# EAGLE design phoreo (EAGLE 9.0.0)
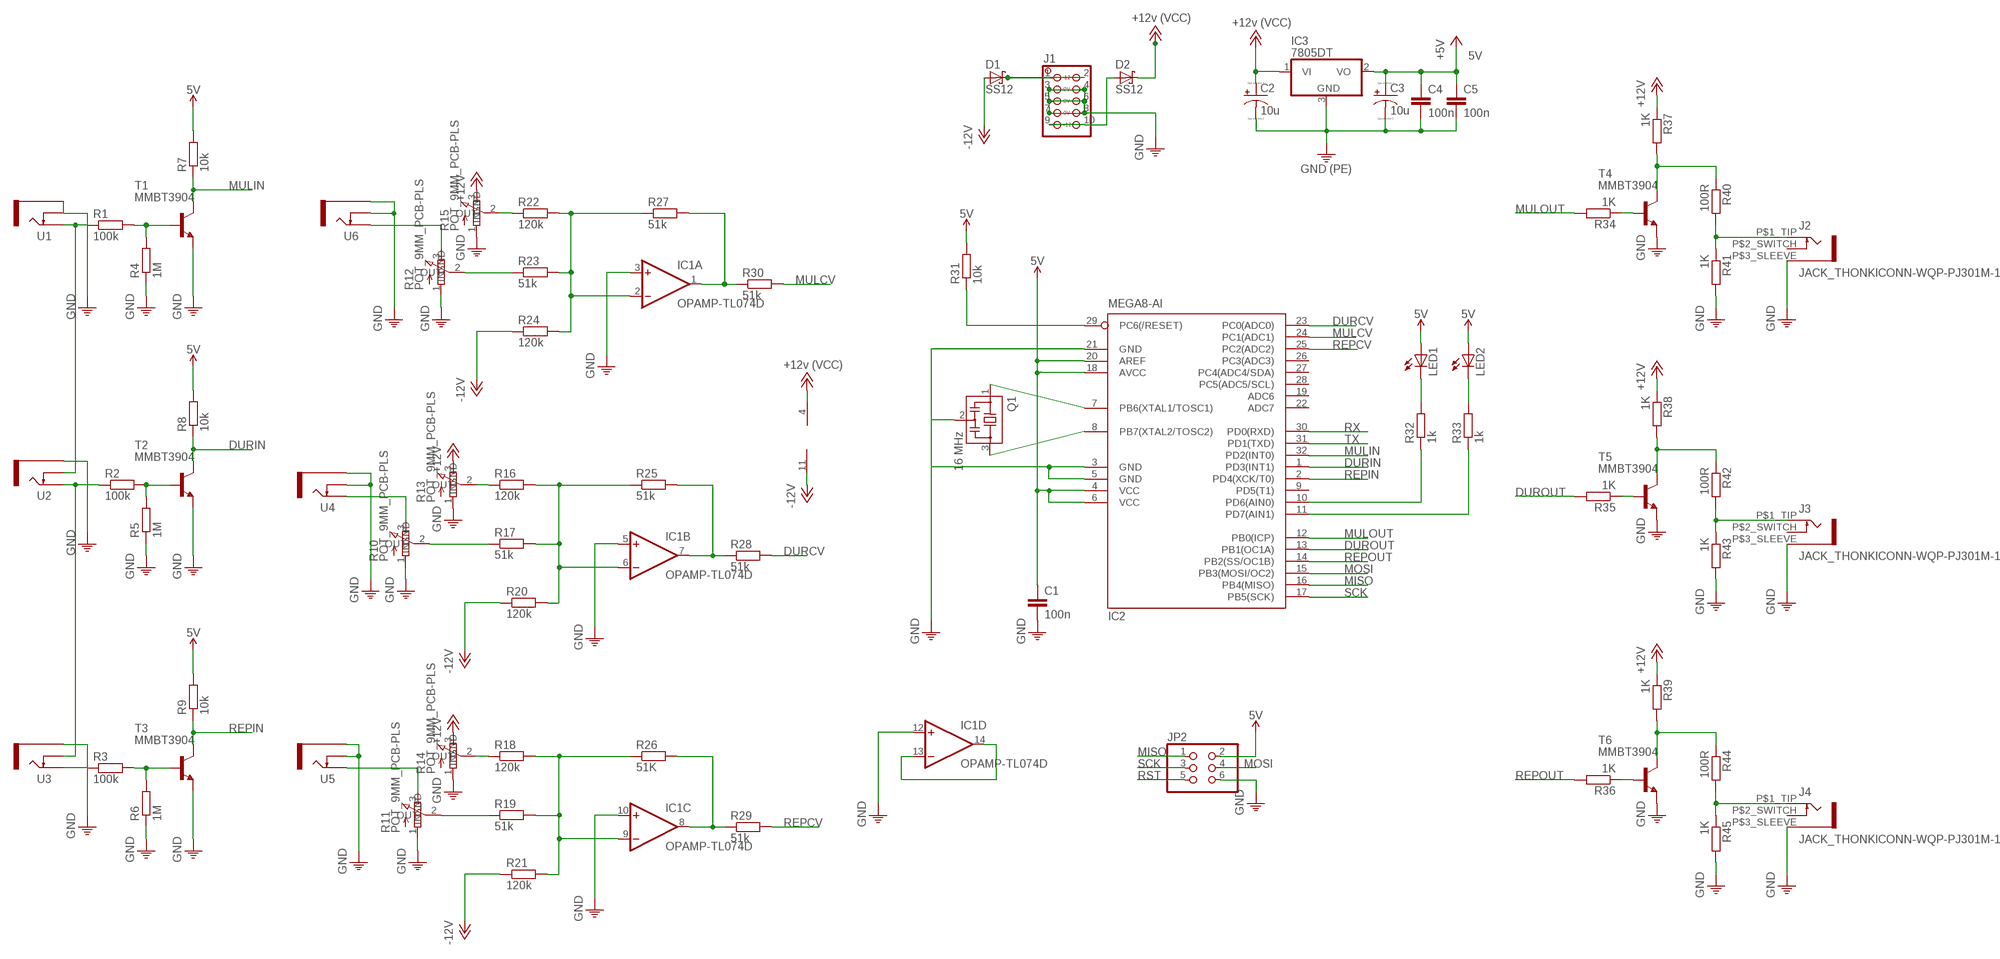
[diagram p0: schematic, sheet 1]

## Parts
C1  100n  CAPACITOR-EUC0603K  [C0603K]
C2  10u  CAPACITOR_POLARIZED-USB  [PANASONIC_B]
C3  10u  CAPACITOR_POLARIZED-USB  [PANASONIC_B]
C4  100n  CAPACITOR-EUC0603  [C0603]
C5  100n  CAPACITOR-EUC0603  [C0603]
D1  SS12  D_SCHOTTKY-SMA  [SMA_DO214AC]
D2  SS12  D_SCHOTTKY-SMA  [SMA_DO214AC]
IC1  OPAMP-TL074D  [SO14]
IC2  MEGA8-AI  [TQFP32-08]
IC3  7805DT  [TO252]
J1  HEADER-EUROPWR_2X05-OPEN  [2X05_EUROPWR_OPEN]
J2  JACK_THONKICONN-WQP-PJ301M-12  [WQP-PJ301M-12_JACK]
J3  JACK_THONKICONN-WQP-PJ301M-12  [WQP-PJ301M-12_JACK]
J4  JACK_THONKICONN-WQP-PJ301M-12  [WQP-PJ301M-12_JACK]
JP2  PINHD-2X3  [2X03]
LED1  LED3MM  [LED3MM]
LED2  LED3MM  [LED3MM]
Q1  16 MHz  CSTCR6M00G53Z  [CSTCR6M]
R1  100k  RESISTOR-EU_R0603  [R0603]
R2  100k  RESISTOR-EU_R0603  [R0603]
R3  100k  RESISTOR-EU_R0603  [R0603]
R4  1M  RESISTOR-EU_R0603  [R0603]
R5  1M  RESISTOR-EU_R0603  [R0603]
R6  1M  RESISTOR-EU_R0603  [R0603]
R7  10k  RESISTOR-EU_R0603  [R0603]
R8  10k  RESISTOR-EU_R0603  [R0603]
R9  10k  RESISTOR-EU_R0603  [R0603]
R10  POT_9MM_PCB-PLS  [9MM_PLS]
R11  POT_9MM_PCB-PLS  [9MM_PLS]
R12  POT_9MM_PCB-PLS  [9MM_PLS]
R13  POT_9MM_PCB-PLS  [9MM_PLS]
R14  POT_9MM_PCB-PLS  [9MM_PLS]
R15  POT_9MM_PCB-PLS  [9MM_PLS]
R16  120k  RESISTOR-EU_R0603  [R0603]
R17  51k  RESISTOR-EU_R0603  [R0603]
R18  120k  RESISTOR-EU_R0603  [R0603]
R19  51k  RESISTOR-EU_R0603  [R0603]
R20  120k  RESISTOR-EU_R0603  [R0603]
R21  120k  RESISTOR-EU_R0603  [R0603]
R22  120k  RESISTOR-EU_R0603  [R0603]
R23  51k  RESISTOR-EU_R0603  [R0603]
R24  120k  RESISTOR-EU_R0603  [R0603]
R25  51k  RESISTOR-EU_R0603  [R0603]
R26  51K  RESISTOR-EU_R0603  [R0603]
R27  51k  RESISTOR-EU_R0603  [R0603]
R28  51k  RESISTOR-EU_R0603  [R0603]
R29  51k  RESISTOR-EU_R0603  [R0603]
R30  51k  RESISTOR-EU_R0603  [R0603]
R31  10k  RESISTOR-EU_R0603  [R0603]
R32  1k  RESISTOR-EU_R0603  [R0603]
R33  1k  RESISTOR-EU_R0603  [R0603]
R34  1K  RESISTOR-EU_R0603  [R0603]
R35  1K  RESISTOR-EU_R0603  [R0603]
R36  1K  RESISTOR-EU_R0603  [R0603]
R37  1K  RESISTOR-EU_R0603  [R0603]
R38  1K  RESISTOR-EU_R0603  [R0603]
R39  1K  RESISTOR-EU_R0603  [R0603]
R40  100R  RESISTOR-EU_R0603  [R0603]
R41  1K  RESISTOR-EU_R0603  [R0603]
R42  100R  RESISTOR-EU_R0603  [R0603]
R43  1K  RESISTOR-EU_R0603  [R0603]
R44  100R  RESISTOR-EU_R0603  [R0603]
R45  1K  RESISTOR-EU_R0603  [R0603]
T1  MMBT3904  TRANSISTOR-NPN-MMBT3904LT1SOT23-BEC  [SOT23-BEC]
T2  MMBT3904  TRANSISTOR-NPN-MMBT3904LT1SOT23-BEC  [SOT23-BEC]
T3  MMBT3904  TRANSISTOR-NPN-MMBT3904LT1SOT23-BEC  [SOT23-BEC]
T4  MMBT3904  TRANSISTOR-NPN-MMBT3904LT1SOT23-BEC  [SOT23-BEC]
T5  MMBT3904  TRANSISTOR-NPN-MMBT3904LT1SOT23-BEC  [SOT23-BEC]
T6  MMBT3904  TRANSISTOR-NPN-MMBT3904LT1SOT23-BEC  [SOT23-BEC]
U1  mulcv  JACK_THONKICONNNEW  [WQP-PJ301M-12_JACK]
U2  mulcv  JACK_THONKICONNNEW  [WQP-PJ301M-12_JACK]
U3  mulcv  JACK_THONKICONNNEW  [WQP-PJ301M-12_JACK]
U4  mulcv  JACK_THONKICONNNEW  [WQP-PJ301M-12_JACK]
U5  mulcv  JACK_THONKICONNNEW  [WQP-PJ301M-12_JACK]
U6  mulcv  JACK_THONKICONNNEW  [WQP-PJ301M-12_JACK]

## Nets
5V: C1.1 C3.+ C4.1 C5.1 IC2.4(VCC) IC2.6(VCC) IC2.18(AVCC) IC2.20(AREF) IC3.2(VO) JP2.2 LED1.A LED2.A R7.2 R8.2 R9.2 R31.2 ; supply symbol labelled +5V
+12V [GND]: C2.+ D2.C IC1.4(P:V+) IC3.1(VI) R13.3(IN) R14.3(IN) R15.3(IN) R37.1 R38.1 R39.1 ; supply symbol labelled POWER+12V
-12V [GND]: D1.A IC1.11(P:V-) R20.1 R21.1 R24.1
DURCV: IC2.23(PC0(ADC0)) R28.2
DURIN: IC2.1(PD3(INT1)) R8.1 T2.C
DUROUT: IC2.13(PB1(OC1A)) R35.2
MISO: IC2.16(PB4(MISO)) JP2.1
MOSI: IC2.15(PB3(MOSI/OC2)) JP2.4
MULCV: IC2.24(PC1(ADC1)) R30.2
MULIN: IC2.32(PD2(INT0)) R7.1 T1.C
MULOUT: IC2.12(PB0(ICP)) R34.2
N$2: IC2.7(PB6(XTAL1/TOSC1)) Q1.1
N$3: D1.C J1.1 J1.2
N$4: IC2.8(PB7(XTAL2/TOSC2)) Q1.3
N$5: IC2.29(PC6(/RESET)) R31.1
N$6: R34.1 T4.B
N$7 [GND]: D2.A J1.9 J1.10
N$8: IC2.10(PD6(AIN0)) R32.1
N$9: IC2.11(PD7(AIN1)) R33.1
N$10: LED1.K(C) R32.2
N$11: LED2.K(C) R33.2
N$12: IC1.2(A:-IN) R22.2 R23.2 R24.2 R27.1
N$13: IC1.1(A:OUT) R27.2 R30.1
N$14: IC1.6(B:-IN) R16.2 R17.2 R20.2 R25.1
N$15: IC1.7(B:OUT) R25.2 R28.1
N$16: R10.3(IN) U4.P$1_TIP(TIP)
N$17: R10.2(OUT) R17.1
N$18: R12.3(IN) U6.P$1_TIP(TIP)
N$19: R12.2(OUT) R23.1
N$20: R15.2(OUT) R22.1
N$21: R13.2(OUT) R16.1
N$22: IC1.9(C:-IN) R18.2 R19.2 R21.2 R26.1
N$23: IC1.8(C:OUT) R26.2 R29.1
N$24: R11.3(IN) U5.P$1_TIP(TIP)
N$25: R11.2(OUT) R19.1
N$26: R14.2(OUT) R18.1
N$27: IC1.13(D:-IN) IC1.14(D:OUT)
N$28: R37.2 R40.1 T4.C
N$29: J2.P$1_TIP R40.2 R41.1
N$30: R35.1 T5.B
N$31: R38.2 R42.1 T5.C
N$32: J3.P$1_TIP R42.2 R43.1
N$33: R36.1 T6.B
N$34: R39.2 R44.1 T6.C
N$35: J4.P$1_TIP R44.2 R45.1
N$36: R1.1 U1.P$1_TIP(TIP) U2.P$2_SWITCH(SWITCH)
N$37: R1.2 R4.2 T1.B
N$38 [GND]: R2.1 U2.P$1_TIP(TIP) U3.P$2_SWITCH(SWITCH)
N$40: R2.2 R5.2 T2.B
N$42: R3.1 U3.P$1_TIP(TIP)
N$43: R3.2 R6.2 T3.B
PE [GND]: C1.2 C2.- C3.- C4.2 C5.2 IC1.3(A:+IN) IC1.5(B:+IN) IC1.10(C:+IN) IC1.12(D:+IN) IC2.3(GND) IC2.5(GND) IC2.21(GND) IC3.3(GND) J1.3 J1.4 J1.5 J1.6 J1.7 J1.8 J2.P$3_SLEEVE J3.P$3_SLEEVE J4.P$3_SLEEVE JP2.6 Q1.2 R4.1 R5.1 R6.1 R10.1(GND) R11.1(GND) R12.1(GND) R13.1(GND) R14.1(GND) R15.1(GND) R41.2 R43.2 R45.2 T1.E T2.E T3.E T4.E T5.E T6.E U1.P$2_SWITCH(SWITCH) U1.P$3_SLEEVE(SLEEVE) U2.P$3_SLEEVE(SLEEVE) U3.P$3_SLEEVE(SLEEVE) U4.P$2_SWITCH(SWITCH) U4.P$3_SLEEVE(SLEEVE) U5.P$2_SWITCH(SWITCH) U5.P$3_SLEEVE(SLEEVE) U6.P$2_SWITCH(SWITCH) U6.P$3_SLEEVE(SLEEVE) ; supply symbol labelled GND, POWER-GND
REPCV: IC2.25(PC2(ADC2)) R29.2
REPIN: IC2.2(PD4(XCK/T0)) R9.1 T3.C
REPOUT: IC2.14(PB2(SS/OC1B)) R36.2
RST: JP2.5
RX: IC2.30(PD0(RXD))
SCK: IC2.17(PB5(SCK)) JP2.3
TX: IC2.31(PD1(TXD))
Unconnected: IC2.9(PD5(T1)) IC2.19(ADC6) IC2.22(ADC7) IC2.26(PC3(ADC3)) IC2.27(PC4(ADC4/SDA)) IC2.28(PC5(ADC5/SCL)) J2.P$2_SWITCH J3.P$2_SWITCH J4.P$2_SWITCH

## Library data of the parts
C1 C4 C5 = 0000-master:CAPACITOR-EU: CAPACITOR, European symbol
C2 C3 = 0000-master:CAPACITOR_POLARIZED-US: POLARIZED CAPACITOR, American symbol
D1 D2 = we-rcl:D_SCHOTTKY: Schottky Diodes 1A, 30V - SOD323 (BAS3010 or CUS10S40) 3A, 100V - SOD123 (S310A)
IC1 = 0000-master:OPAMP-TL074: OP AMP
IC2 = atmel:MEGA8: MICROCONTROLLER 8 Kbytes FLASH, 1 kbytes SRAM, 512 bytes EEPROM, USART, 6-channel 10 bit ADC, 2-channel 8 bit ADC Pin compatible with Atmega48, ATMega88, ATMega168 Source: avr.lbr; MPN: ATMEGA8-16AU; OC_FARNELL: 9171371; OC_NEWARK: 73M8863
IC3 = linear:78*: Positive VOLTAGE REGULATOR Source: http://cache.national.com/ds/LM/LM78L05.pdf http://www.fairchildsemi.com/ds/LM/LM7805.pdf
J1 = 0000-master:HEADER-EUROPWR_2X05: 2x05 pin header
J2-J4 = 0000-master:JACK_THONKICONN-WQP-PJ301M-12
JP2 = pinhead:PINHD-2X3: PIN HEADER
LED1 LED2 = 0000-master:LED: LED OSRAM: - CHIPLED LG R971, LG N971, LY N971, LG Q971, LY Q971, LO R971, LY R971 LH N974, LH R974 LS Q976, LO Q976, LY Q976 LO Q996 - Hyper CHIPLED LW Q18S LB Q993, LB Q99A, LB R99A - SideLED LS A670, LO A670, LY A670, LG A670, LP A670 LB A673, LV A673, LT A673, LW A673 LH A674 LY A675 LS A676, LA A676, LO A676, LY A676, LW A676 LS A679, LY A679, LG A679 - Hyper Micro SIDELED® LS Y876, LA Y876, LO Y876, LY Y876 LT Y87S - SmartLED LW L88C, LW L88S LB L89C, LB L89S, LG L890 LS L89K, LO L89K, LY L89K LS L896, LA L896, LO L896, LY L896 - TOPLED LS T670, LO T670, LY T670, LG T670, LP T670 LSG T670, LSP T670, LSY T670, LOP T670, LYG T670 LG T671, LOG T671, LSG T671 LB T673, LV T673, LT T673, LW T673 LH T674 LS T676, LA T676, LO T676, LY T676, LB T676, LH T676, LSB T676, LW T676 LB T67C, LV T67C, LT T67C, LS T67K, LO T67K, LY T67K, LW E67C LS E67B, LA E67B, LO E67B, LY E67B, LB E67C, LV E67C, LT E67C LW T67C LS T679, LY T679, LG T679 LS T770, LO T770, LY T770, LG T770, LP T770 LB T773, LV T773, LT T773, LW T773 LH T774 LS E675, LA E675, LY E675, LS T675 LS T776, LA T776, LO T776, LY T776, LB T776 LHGB T686 LT T68C, LB T68C - Hyper Mini TOPLED® LB M676 - Mini TOPLED Santana® LG M470 LS M47K, LO M47K, LY M47K Source: http://www.osram.convergy.de LUXEON: - LUMILED® LXK2-PW12-R00, LXK2-PW12-S00, LXK2-PW14-U00, LXK2-PW14-V00 LXK2-PM12-R00, LXK2-PM12-S00, LXK2-PM14-U00 LXK2-PE12-Q00, LXK2-PE12-R00, LXK2-PE12-S00, LXK2-PE14-T00, LXK2-PE14-U00 LXK2-PB12-K00, LXK2-PB12-L00, LXK2-PB12-M00, LXK2-PB14-N00, LXK2-PB14-P00, LXK2-PB14-Q00 LXK2-PR12-L00, LXK2-PR12-M00, LXK2-PR14-Q00, LXK2-PR14-R00 LXK2-PD12-Q00, LXK2-PD12-R00, LXK2-PD12-S00 LXK2-PH12-R00, LXK2-PH12-S00 LXK2-PL12-P00, LXK2-PL12-Q00, LXK2-PL12-R00 Source: www.luxeon.com KINGBRIGHT: KA-3528ASYC Source: www.kingbright.com
Q1 = murata-filter:CSTCR: Resonator Source: murata.co.jp; MPN: CSTCR6M00G53-R0; OC_FARNELL: 1170434; OC_NEWARK: 25M8759
R1-R9 R16-R45 = 0000-master:RESISTOR-EU_: RESISTOR, European symbol
R10-R15 = 0000-master:POT_9MM_PCB: 9 mm Square Rotary Potentiometers Source: Panasonic
T1-T6 = 0000-master:TRANSISTOR-NPN-: NPN Transistror BF959 corrected 2008.03.06
U1-U6 = 0000-master:JACK_THONKICONN: 3.5mm socket for Eurorack modular synths

## Net classes
0 default: width 0.203 mm
1 GND: width 0.305 mm

## Board
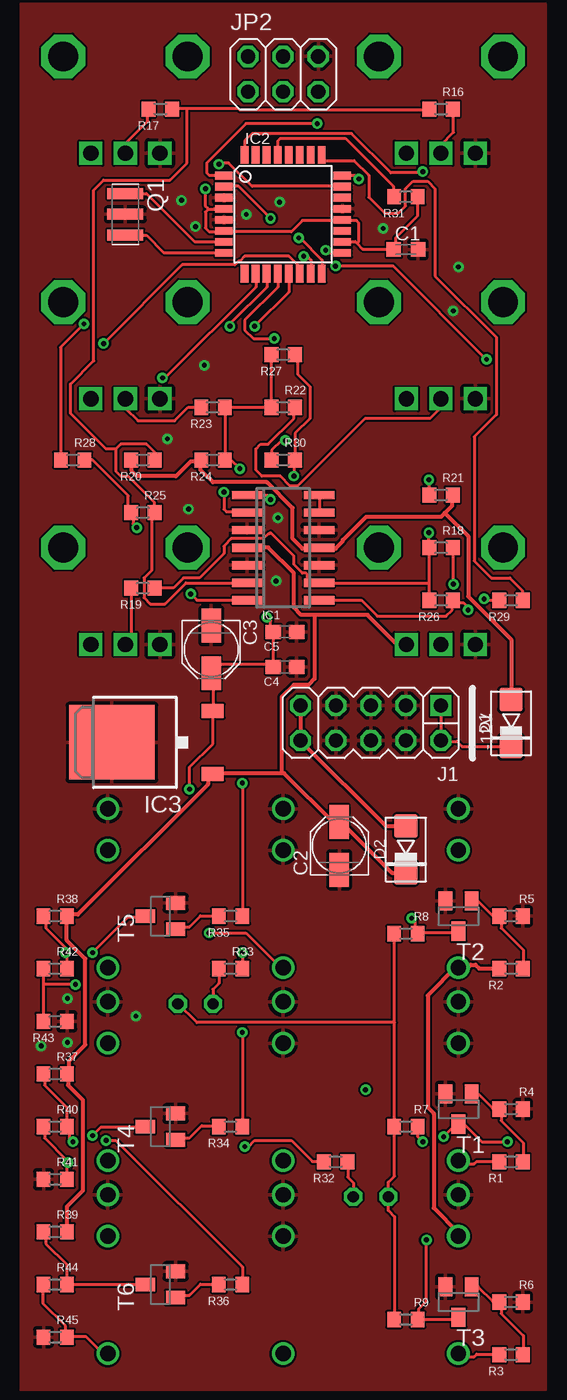
[diagram p1: board, top side]
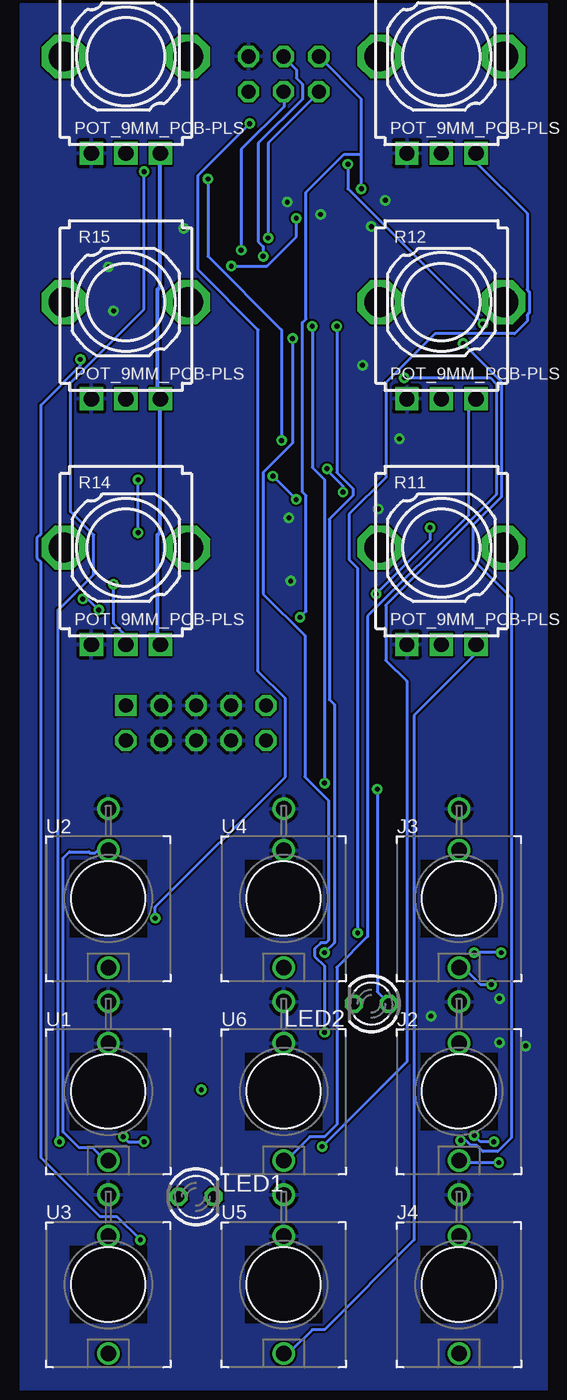
[diagram p2: board, bottom side, seen from below]

No outline drawn. Coordinates in mm, seen from the top.
Copper layers (1*16): Top 0.035mm / dielectric 1.5mm / Bottom 0.035mm
Design rules "default *": minimum track width 6mil, minimum drill 0.35mm, track to track 6mil, track to pad 6mil, pad to pad 6mil, via to via 6mil, smd to smd 6mil, copper to edge 40mil, drill to drill 6mil, minimum pad ring 10mil, minimum via ring 8mil, stop-mask expansion 4mil, vias tented up to drill 15mil, thermal gap 10mil

### Footprints (pad centres in the part's own frame; a part is rotated, then mirrored left to right if it is on the bottom)
C0603K = smd 1.05 x 1.08: 1 -0.875,0; 2 0.875,0
PANASONIC_B = smd 2.454 x 1.4: + 1.727,0; - -1.727,0
C0603 = smd 1.1 x 1: 1 -0.85,0; 2 0.85,0
SMA_DO214AC = smd 1.7 x 1.7: A 0,-1.7; C 0,1.7
SO14 = smd 0.6 x 2.2: 1 -3.81,-2.6; 2 -2.54,-2.6; 3 -1.27,-2.6; 4 0,-2.6; 5 1.27,-2.6; 6 2.54,-2.6; 7 3.81,-2.6; 8 3.81,2.6; 9 2.54,2.6; 10 1.27,2.6; 11 0,2.6; 12 -1.27,2.6; 13 -2.54,2.6; 14 -3.81,2.6
TQFP32-08 = smd 1.27 x 0.559: 1 -4.293,2.8; 2 -4.293,2; 3 -4.293,1.2; 4 -4.293,0.4; 5 -4.293,-0.4; 6 -4.293,-1.2; 7 -4.293,-2; 8 -4.293,-2.8; 17 4.293,-2.8; 18 4.293,-2; 19 4.293,-1.2; 20 4.293,-0.4; 21 4.293,0.4; 22 4.293,1.2; 23 4.293,2; 24 4.293,2.8 | smd 0.559 x 1.27: 9 -2.8,-4.293; 10 -2,-4.293; 11 -1.2,-4.293; 12 -0.4,-4.293; 13 0.4,-4.293; 14 1.2,-4.293; 15 2,-4.293; 16 2.8,-4.293; 25 2.8,4.293; 26 2,4.293; 27 1.2,4.293; 28 0.4,4.293; 29 -0.4,4.293; 30 -1.2,4.293; 31 -2,4.293; 32 -2.8,4.293
TO252 = smd 1 x 1.6: 1 -2.28,-4.8; 2 2.28,-4.8 | smd 5.4 x 6.2: 3 0,2.5
2X05_EUROPWR_OPEN = drill 1.016 square: 1 -5.08,-1.27 | drill 1.016 octagon: 2 -5.08,1.27; 3 -2.54,-1.27; 4 -2.54,1.27; 5 0,-1.27; 6 0,1.27; 7 2.54,-1.27; 8 2.54,1.27; 9 5.08,-1.27; 10 5.08,1.27
WQP-PJ301M-12_JACK = drill 1.1: P$1_TIP 0,5; P$2_SWITCH 0,-3.5; P$3_SLEEVE 0,-6.5
2X03 = drill 1.016 octagon: 1 -2.54,-1.27; 2 -2.54,1.27; 3 0,-1.27; 4 0,1.27; 5 2.54,-1.27; 6 2.54,1.27
LED3MM = drill 0.813 octagon: A -1.27,0; K 1.27,0
CSTCR6M = smd 0.8 x 2.6: 1 -1.5,0; 2 0,0; 3 1.5,0
R0603 = smd 1 x 1.1: 1 -0.85,0; 2 0.85,0
9MM_PLS = drill 1.1 pad 1.676 square: 1 -2.5,-7; 2 0,-7; 3 2.5,-7 | drill 2.159 pad 3.175 octagon: M1 4.5,0; M2 -4.5,0
SOT23-BEC = smd 1 x 1.4: B -0.95,-1.1; C 0,1.1; E 0.95,-1.1

### Placement (x,y rotation side)
C1  27.94,82.55 0 top
C2  23.11,39.37 90 top
C3  13.84,53.59 270 top
C4  19.18,52.32 0 top
C5  19.18,54.86 0 top
D1  35.56,48.26 180 top
D2  27.94,39.12 180 top
IC1  19.05,60.96 270 top
IC2  19.05,85.09 0 top
IC3  9.14,46.86 90 top
J1  25.4,48.26 180 top
J2  6.35,21.59 180 bottom
J3  6.35,35.56 180 bottom
J4  6.35,7.62 180 bottom
JP2  19.05,95.25 0 top
LED1  25.4,13.97 0 bottom
LED2  12.7,27.94 180 bottom
Q1  7.62,85.09 270 top
R1  35.56,16.51 0 top
R2  35.56,30.48 0 top
R3  35.56,2.54 0 top
R4  35.56,20.32 180 top
R5  35.56,34.29 180 top
R6  35.56,6.35 180 top
R7  27.94,19.05 180 top
R8  27.94,33.02 180 top
R9  27.94,5.08 180 top
R10  7.62,96.52 0 bottom
R11  7.62,60.96 0 bottom
R12  7.62,78.74 0 bottom
R13  30.48,96.52 0 bottom
R14  30.48,60.96 0 bottom
R15  30.48,78.74 0 bottom
R16  30.48,92.71 180 top
R17  10.16,92.71 0 top
R18  30.48,60.96 180 top
R19  8.89,58.04 0 top
R20  8.89,67.31 0 top
R21  30.48,64.77 180 top
R22  19.05,71.12 180 top
R23  13.97,71.12 0 top
R24  13.97,67.31 0 top
R25  8.89,63.5 180 top
R26  30.48,57.15 0 top
R27  19.05,74.93 0 top
R28  3.81,67.31 180 top
R29  35.56,57.15 0 top
R30  19.05,67.31 180 top
R31  27.94,86.36 0 top
R32  22.86,16.51 0 top
R33  15.24,30.48 180 top
R34  15.24,19.05 0 top
R35  15.24,34.29 0 top
R36  15.24,7.62 0 top
R37  2.54,22.86 180 top
R38  2.54,34.29 180 top
R39  2.54,11.43 180 top
R40  2.54,19.05 180 top
R41  2.54,15.24 180 top
R42  2.54,30.48 180 top
R43  2.54,26.67 0 top
R44  2.54,7.62 180 top
R45  2.54,3.81 180 top
T1  31.75,20.32 180 top
T2  31.75,34.29 180 top
T3  31.75,6.35 180 top
T4  10.16,19.05 90 top
T5  10.16,34.29 90 top
T6  10.16,7.62 90 top
U1  31.75,21.59 180 bottom
U2  31.75,35.56 180 bottom
U3  31.75,7.62 180 bottom
U4  19.05,35.56 180 bottom
U5  19.05,7.62 180 bottom
U6  19.05,21.59 180 bottom

### Tracks (layer width: path | path; a pad name or v marks a point on that pad's centre or on a via)
5V  (via drill 0.35)
  Top 0.203: 13.6,85.43 13.42,85.25 13.42,84.1 13.69,83.83 14.76,83.83 IC2.6 14.85,83.83 19.65,83.83 20.45,84.63 23.29,84.63 IC2.20 23.38,84.63 24.36,84.63 24.54,84.45 24.54,83.12 24.4,82.99 | 13.6,85.43 14.05,85.43 14.13,85.52 14.76,85.52 IC2.4 | 24.4,82.99 24.27,83.12 23.38,83.12 IC2.18 | 24.4,82.99 24.8,82.59 27.03,82.59 C1.1 27.03,82.68 27.2,82.86 27.2,83.39 28.8,84.99 28.8,86.32 R31.2 | v13.42,86.94 13.42,85.7 13.6,85.52 13.6,85.43 | R9.2 27.11,5.16 27.11,12.54 26.67,12.98 LED1.A 26.67,15.02 27.11,15.47 27.11,19.02 R7.2 27.11,19.11 27.11,26.58 | 27.11,26.58 27.11,32.98 R8.2 | 27.11,26.58 12.8,26.58 11.44,27.94 LED2.A | v12.27,43.47 12.27,45.07 13.96,46.76 13.96,49.07 IC3.2 13.96,49.16 13.96,51.83 13.87,51.92 C3.+ 13.87,52.01 14.4,52.54 18.22,52.54 C4.1 18.31,52.36 18.31,54.85 C5.1 18.31,54.94 18.14,55.12 18.14,55.65 v17.87,55.92
  Bottom 0.203: JP2.2 13.42,93.43 13.42,89.43 | v13.42,86.94 13.42,89.43 | v12.27,43.47 12.27,28.8 11.43,27.96 LED2.A | 13.42,89.43 14.67,89.43 17.42,86.68 17.42,77.52 17.69,77.25 17.69,64.99 17.42,64.72 17.42,56.36 v17.87,55.92
+12V
  Top 0.305: R39.1 3.38,11.47 3.38,13.25 4.53,14.4 4.53,20.98 3.47,22.05 3.47,22.85 R37.1 3.56,22.94 3.56,23.82 4.71,24.98 4.71,31.2 3.38,32.54 3.38,34.23 R38.1 3.47,34.4 4.18,34.4 13.6,43.83 13.6,44.18 13.87,44.45 IC3.1 13.96,44.63 18.94,44.63 | 18.94,44.63 19.11,44.63 22.76,40.98 23.11,40.98 C2.+ 23.2,40.89 23.47,40.89 26.94,37.43 27.91,37.43 D2.C | 21.34,56.1 25.16,56.1 27.29,53.96 27.91,53.96 R14.3 | 21.34,56.1 20.36,56.1 19.82,56.63 19.82,59.12 17.96,60.98 16.54,60.98 IC1.4 | 18.94,44.63 18.94,50.14 19.82,51.03 20.89,51.03 21.34,51.47 21.34,56.1
  Bottom 0.305: R14.3 28,53.96 28.18,54.14 28.18,61.87 28,62.05 28,71.65 R15.3 28.09,71.83 28.18,71.92 28.18,79.65 28,79.83 28,89.43 R13.3
-12V
  Top 0.305: R20.1 8.09,67.3 8.09,66.5 8.45,66.14 11.29,66.14 12.36,67.21 12.98,67.21 13.07,67.3 R24.1 13.07,67.12 13.07,66.59 13.96,65.7 17.87,65.7 19.74,63.83 19.74,61.61 20.45,60.9 21.51,60.9 IC1.11 21.69,60.9 22.85,60.9 23.38,61.43 23.38,61.52 25.07,63.21 30.49,63.21 30.76,63.48 | 30.76,63.48 31.29,64.01 31.29,64.72 R21.1 | D1.A 35.56,54.32 32.45,57.43 32.45,61.78 30.76,63.48
DURCV  (via drill 0.35)
  Top 0.203: v4.62,77.17 2.93,75.48 2.93,67.39 R28.2 | v14.4,88.72 14.49,88.81 15.11,88.81 16.8,87.12 23.29,87.12 IC2.23
  Bottom 0.203: v4.62,77.17 14.4,86.94 v14.4,88.72
DURIN  (via drill 0.35)
  Top 0.203: T2.C 31.74,33.16 31.65,33.07 28.8,33.07 R8.1 28.8,33.16 28.63,33.34 28.63,33.87 v28.36,34.14 | v21.51,91.66 16.36,91.66 13.51,88.81 13.51,88.1 13.69,87.92 14.76,87.92 IC2.1
  Bottom 0.203: v21.51,91.66 25.25,87.92 25.25,81.08 20.89,76.72 20.89,52.01 18.94,50.05 18.94,44.36 28.36,34.94 v28.36,34.14
DUROUT  (via drill 0.35)
  Top 0.203: v16.09,43.92 16.09,34.31 R35.2 | v16.98,76.99 19.47,79.48 19.47,80.72 IC2.13
  Bottom 0.203: v16.09,43.92 16.09,65.88 16.98,66.76 v16.98,76.99
MISO  (via drill 0.35)
  Top 0.203: v20.18,83.39 20.27,83.39 21.87,81.79 21.87,80.81 IC2.16
  Bottom 0.203: v20.18,83.39 20.18,90.23 16.45,93.97 JP2.1
MOSI  (via drill 0.35)
  Top 0.203: v20.54,82.06 20.8,82.06 21.07,81.79 21.07,80.81 IC2.15
  Bottom 0.203: v20.54,82.06 20.54,82.77 20.89,83.12 20.89,90.23 17.69,93.43 17.69,94.5 18.14,94.94 18.14,95.57 19.02,96.46 JP2.4
MULCV  (via drill 0.35)
  Top 0.203: v19.2,68.72 18.94,68.72 18.22,68.01 18.22,67.39 R30.2 | v24.54,87.66 24.27,87.92 23.38,87.92 IC2.24
  Bottom 0.203: v19.2,68.72 19.2,76.72 24.54,82.06 v24.54,87.66
MULIN  (via drill 0.35)
  Top 0.203: v29.16,17.96 28.8,18.31 28.8,19.02 R7.1 | v30.67,18.31 31.56,19.2 31.74,19.2 T1.C 31.83,19.2 32.18,19.2 33.43,17.96 v35.29,17.96 | v29.16,88.19 29.07,88.1 26.85,88.1 24,90.94 16.8,90.94 16.27,90.41 16.27,89.43 IC2.32
  Bottom 0.203: v29.16,17.96 30.32,17.96 v30.67,18.31 | v29.16,88.19 29.16,78.23 34.49,72.9 34.49,63.56 32.8,61.87 32.8,59.03 35.38,56.45 35.38,18.05 v35.29,17.96
MULOUT  (via drill 0.35)
  Top 0.203: v16.09,25.87 16.09,19.11 R34.2 | v18.4,76.1 16.89,76.1 16.27,76.72 16.27,77.43 18.67,79.83 18.67,80.72 IC2.12
  Bottom 0.203: v16.09,25.87 16.09,30.67 16.8,31.38 16.8,31.91 16.36,32.36 16,32.36 15.82,32.54 15.82,42.67 17.51,44.36 17.51,54.59 20.54,57.61 20.54,66.41 18.4,68.54 v18.4,76.1
N$2
  Top 0.203: IC2.7 14.76,83.12 12.62,83.12 9.16,86.59 7.64,86.59 Q1.1
N$3
  Top 0.203: D1.C 35.56,46.58 32,46.58 31.65,46.94 30.49,46.94 J1.2 30.49,47.03 30.49,49.52 J1.1
N$4
  Top 0.203: IC2.8 14.76,82.32 10.4,82.32 9.16,83.57 7.64,83.57 Q1.3
N$5
  Top 0.203: R31.1 27.03,86.41 27.03,87.12 23.56,90.59 18.85,90.59 18.67,90.41 18.67,89.43 IC2.29
N$6
  Top 0.203: R34.1 14.31,19.11 13.16,19.11 12.27,18.22 11.38,18.22 11.29,18.14 T4.B
N$7
  Top 0.305: D2.A 27.91,40.8 26.49,40.8 20.36,46.94 J1.10 20.36,47.12 20.36,49.52 J1.9
N$8  (via drill 0.35)
  Top 0.203: v16.27,17.6 16.54,17.6 16.98,18.05 19.65,18.05 21.16,16.54 21.96,16.54 R32.1 | v10.31,73.25 10.49,73.25 17.07,79.83 17.07,80.72 IC2.10
  Bottom 0.203: v16.27,17.6 10.13,23.74 10.13,51.3 11.65,52.81 11.65,56.81 3.65,64.81 3.65,72.81 4.09,73.25 v10.31,73.25
N$9  (via drill 0.35)
  Top 0.203: v16.09,31.65 16.09,30.49 R33.1 | v15.2,76.99 15.2,77.17 17.87,79.83 17.87,80.72 IC2.11
  Bottom 0.203: v16.09,31.65 15.38,32.36 15.38,49.61 15.73,49.96 15.73,63.03 14.05,64.72 14.05,65.25 15.2,66.41 v15.2,76.99
N$10
  Top 0.203: R32.2 23.74,16.45 23.74,15.38 24.13,14.99 LED1.K
N$11
  Top 0.203: R33.2 14.4,30.4 14.4,29.43 13.97,28.99 LED2.K
N$12  (via drill 0.35)
  Top 0.203: R27.1 18.22,74.85 18.22,71.21 R22.2 R23.2 14.85,71.12 14.85,67.39 R24.2 14.94,67.39 15.2,67.39 v15.91,66.67 | v14.76,64.99 14.76,63.74 14.94,63.56 16.45,63.56 IC1.2
  Bottom 0.203: v14.76,64.99 14.76,65.43 15.91,66.59 v15.91,66.67
N$13  (via drill 0.35)
  Top 0.203: R27.2 19.91,74.85 20.09,74.68 20.09,73.52 20.98,72.63 20.98,70.32 19.91,69.25 19.91,67.39 R30.1 19.82,67.3 v19.82,66.14 | v18.14,64.45 18.14,64.54 17.96,64.72 16.54,64.72 IC1.1
  Bottom 0.203: v19.82,66.14 v18.14,64.45
N$14
  Top 0.203: 12.09,92.72 15.82,92.72 15.91,92.63 29.6,92.63 R16.2 | 12.09,92.72 11.02,92.72 R17.2 | 6.93,68.1 6.93,66.5 7.29,66.14 7.82,66.14 9.69,64.28 9.69,63.56 R25.1 9.69,63.48 9.51,63.3 9.51,59.3 8.98,58.76 8.98,57.34 9.42,56.9 10.49,56.9 12,58.41 16.45,58.41 IC1.6 | 6.93,68.1 7.29,68.45 9.16,68.45 9.78,67.83 9.78,67.39 R20.2 | 12.09,92.72 12.09,88.81 10.85,87.57 6.04,87.57 5.33,86.86 5.33,74.5 3.65,72.81 3.65,70.67 6.22,68.1 6.93,68.1
N$15  (via drill 0.35)
  Top 0.203: R28.1 4.71,67.3 5.25,67.3 7.82,64.72 7.82,63.74 8,63.56 R25.2 8.09,63.48 8.18,63.39 8.18,62.67 v8.45,62.41 | v12.36,57.61 12.8,57.16 16.45,57.16 IC1.7
  Bottom 0.203: v12.36,57.61 8.45,61.52 v8.45,62.41
N$16  (via drill 0.35)
  Top 0.203: v13.69,33.07 16.36,33.07 18.85,30.58 19.02,30.58 U4.P$1_TIP
  Bottom 0.203: v13.69,33.07 13.69,59.47 14.31,60.1 14.31,63.39 11.65,66.05 11.65,72.9 8.09,76.45 2.31,76.45 1.42,77.34 1.42,77.79 1.25,77.97 1.25,79.48 1.42,79.65 1.42,85.17 5.07,88.81 5.07,89.43 R10.3
N$17
  Top 0.203: R17.1 9.25,92.63 9.25,91.83 7.64,90.23 7.64,89.52 R10.2
N$18
  Bottom 0.203: U6.P$1_TIP 19.02,16.62 18.85,16.62 17.16,18.31 16.09,18.31 15.2,19.2 15.2,30.58 12.98,32.8 12.98,56.01 5.69,63.3 5.69,71.12 5.16,71.65 R12.3
N$19
  Top 0.203: R23.1 12.18,71.12 11.2,70.14 8.53,70.14 7.64,71.03 7.64,71.65 R12.2
N$20
  Top 0.203: R22.1 19.82,71.12 19.82,70.32 17.96,68.45 17.42,68.45 17.07,68.1 17.07,66.59 17.51,66.14 18.85,66.14 19.56,65.43 20.09,65.43 24.98,70.32 29.69,70.32 30.4,71.03 30.4,71.65 R15.2
N$21
  Top 0.203: R16.1 31.38,92.63 31.38,91.03 30.49,90.14 30.49,89.52 R13.2
N$22  (via drill 0.35)
  Top 0.203: 29.6,58.41 29.6,60.9 R18.2 29.6,60.98 v29.6,62.05 | 29.6,58.41 29.6,57.16 R26.1 | v29.6,65.88 29.6,64.81 R21.2 | R19.2 9.78,58.05 11.11,58.05 11.82,58.76 12.98,58.76 14.76,60.54 14.76,61.07 15.29,61.61 17.6,61.61 17.96,61.96 18.05,61.96 18.14,62.05 19.82,60.36 19.82,59.74 20.45,59.12 20.71,59.12 20.8,59.03 20.8,58.67 20.98,58.5 21.6,58.5 IC1.9 21.69,58.41 29.6,58.41
  Bottom 0.203: v29.6,62.05 v29.6,65.88
N$23  (via drill 0.35)
  Top 0.203: IC1.8 21.69,57.16 24.71,57.16 25.87,56.01 30.85,56.01 31.29,56.45 31.29,57.07 R26.2 31.38,56.98 32.09,56.98 32.45,56.63 v32.45,56.45 | v33.6,57.25 33.69,57.16 34.67,57.16 R29.1
  Bottom 0.203: v33.6,57.25 33.25,57.25 v32.45,56.45
N$24
  Bottom 0.203: U5.P$1_TIP 19.02,2.67 18.67,2.67 16.98,4.36 16.09,4.36 9.6,10.85 9.6,48.81 5.16,53.25 5.16,53.87 R11.3
N$25
  Top 0.203: R19.1 8.09,57.96 8.09,54.41 7.64,53.96 R11.2
N$26  (via drill 0.35)
  Top 0.203: v31.38,58.32 31.38,60.9 R18.1
  Bottom 0.203: v31.38,58.32 31.38,55.47 30.49,54.59 30.49,53.96 R14.2
N$27
  Top 0.203: IC1.13 21.69,63.56 21.69,64.72 IC1.14
N$28  (via drill 0.35)
  Top 0.203: R37.2 1.78,22.85 1.78,22.05 3.38,20.45 3.38,19.11 R40.1 3.47,19.02 3.56,18.94 3.56,18.22 v3.82,17.96 | v5.25,18.4 5.87,19.02 8.98,19.02 T4.C
  Bottom 0.203: v5.25,18.4 4.8,17.96 v3.82,17.96
N$29  (via drill 0.35)
  Top 0.203: 3.38,16.45 3.38,16.62 1.78,18.22 1.78,19.02 R40.2 | 3.38,16.45 3.38,15.29 R41.1 | v3.47,16.45 3.38,16.45
  Bottom 0.203: v3.47,16.45 5.51,16.45 5.6,16.54 6.31,16.54 J2.P$1_TIP
N$30
  Top 0.203: R35.1 14.31,34.31 13.07,34.31 12.27,33.52 11.38,33.52 11.29,33.43 T5.B
N$31  (via drill 0.35)
  Top 0.203: 3.38,31.65 3.38,31.91 1.87,33.43 1.87,34.14 1.78,34.23 R38.2 | 3.38,31.65 3.38,30.49 R42.1 | v5.25,31.65 7.82,34.23 8.98,34.23 T5.C | v3.29,31.65 3.38,31.65
  Bottom 0.203: v3.29,31.65 v5.25,31.65
N$32  (via drill 0.35)
  Top 0.203: 1.69,29.34 1.69,30.4 R42.2 | 1.69,29.34 R43.1 | v4,29.34 1.69,29.34
  Bottom 0.203: v4,29.34 4.8,29.34 5.96,30.49 6.31,30.49 J3.P$1_TIP
N$33
  Top 0.203: R36.1 14.31,7.64 13.07,7.64 12.27,6.84 11.38,6.84 11.29,6.76 T6.B
N$34
  Top 0.203: R39.2 1.78,11.38 1.87,11.29 1.87,10.58 3.38,9.07 3.38,7.64 R44.1 3.47,7.64 8.98,7.64 T6.C
N$35
  Top 0.203: J4.P$1_TIP 6.31,2.67 5.96,2.67 4.8,3.82 3.47,3.82 R45.1 3.29,3.82 3.29,4.62 1.69,6.22 1.69,7.56 R44.2
N$36
  Top 0.203: R1.1 34.67,16.54 33.07,16.54 32.89,16.36 32.54,16.36 32.36,16.54 31.83,16.54 U1.P$1_TIP
  Bottom 0.203: U2.P$2_SWITCH 31.83,39.03 32.54,39.03 32.72,38.85 33.07,38.85 33.16,38.94 34.58,38.94 35.03,38.49 35.03,18.67 33.87,17.51 32.89,17.51 32,16.62 31.83,16.62 U1.P$1_TIP
N$37
  Top 0.203: R1.2 36.45,16.54 36.45,17.87 34.85,19.47 34.85,20.18 34.76,20.27 R4.2 34.67,20.36 34.23,20.36 33.25,21.34 32.72,21.34 T1.B
N$38
  Top 0.305: R2.1 34.67,30.49 33.25,30.49 32.98,30.76 32.63,30.76 32.45,30.58 31.83,30.58 U2.P$1_TIP 31.65,30.67 29.52,28.54 29.52,20.45 29.96,20 29.96,13.16 31.74,11.38 31.74,11.2 U3.P$2_SWITCH
N$40
  Top 0.203: T2.B 32.72,35.38 33.16,35.38 34.23,34.31 34.67,34.31 R5.2 34.76,34.23 34.85,34.14 34.85,33.43 36.45,31.83 36.45,30.49 R2.2
N$42
  Top 0.203: R3.1 34.67,2.58 33.07,2.58 32.89,2.4 32.54,2.4 32.36,2.58 31.83,2.58 U3.P$1_TIP
N$43
  Top 0.203: T3.B 32.72,7.47 33.16,7.47 34.23,6.4 34.67,6.4 R6.2 34.76,6.31 34.85,6.22 34.85,5.51 36.45,3.91 36.45,2.58 R3.2
N$44  (via drill 0.35)
  other vias: 25.02,21.72
PE  (via drill 0.35)
  other vias: 10.67,68.83 12.19,63.75 18.67,63.12 18.54,58.55 11.68,86.11 12.7,84.2 16.38,85.09 13.34,74.17 18.8,85.98 26.29,84.07 31.75,81.28 31.37,78.11 1.52,24.89 3.43,25.15 3.43,28.32 8.38,27.05
  pour Top: 0,0 38.1,0 38.1,100.33 0,100.33
  pour Bottom: 0,0 38.1,0 38.1,100.33 0,100.33
REPCV
  Top 0.203: R29.2 36.36,57.16 36.36,57.87 35.47,58.76 34.14,58.76 32.89,60.01 32.89,68.99 34.49,70.59 34.49,76.19 30.05,80.63 30.05,86.94 29.52,87.48 28.45,87.48 27.91,86.94 27.91,85.7 27.38,85.17 26.4,85.17 25.25,86.32 25.25,87.92 24.18,88.99 22.05,88.99 21.87,89.17 21.87,89.34 IC2.25
REPIN  (via drill 0.35)
  Top 0.203: T3.C 31.74,5.25 31.56,5.07 28.8,5.07 R9.1 28.89,5.16 28.89,5.87 29.43,6.4 v29.43,10.85 | v18.14,84.81 15.82,87.12 14.76,87.12 IC2.2 | v22.85,81.34 27.03,81.34 v33.78,74.59
  Bottom 0.203: v18.14,84.81 18.14,83.48 20.27,81.34 v22.85,81.34 | v33.78,74.59 33.78,74.14 36.63,71.3 36.63,61.96 36.89,61.7 36.89,60.19 36.63,59.92 36.63,16.8 32.36,12.54 31.11,12.54 v29.43,10.85
REPOUT  (via drill 0.35)
  Top 0.203: v6.22,18.05 6.93,18.05 16.09,8.89 16.09,7.64 R36.2 | v6.04,75.74 11.73,81.43 15.56,81.43 15.82,81.7 15.91,81.7 16.27,82.06 19.47,82.06 20.18,81.34 20.18,80.81 IC2.14
  Bottom 0.203: v6.22,18.05 5.87,18.05 5.51,17.69 5.07,17.69 4.62,17.25 3.56,17.25 2.58,18.22 2.58,57.34 5.33,60.1 5.33,62.59 3.29,64.63 3.29,72.99 v6.04,75.74
SCK  (via drill 0.35)
  Top 0.203: v22.14,82.5 22.31,82.32 23.29,82.32 IC2.17
  Bottom 0.203: v22.14,82.5 22.14,89.79 19.02,92.9 19.02,93.97 JP2.3